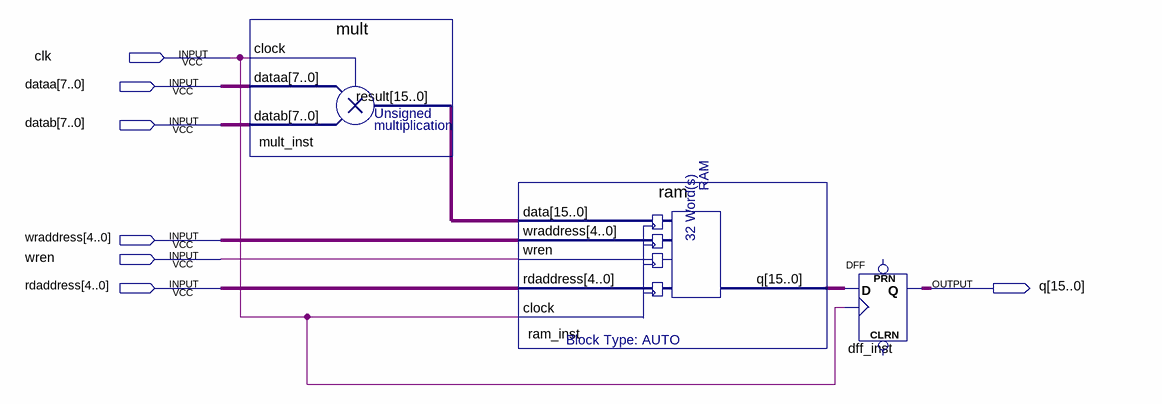
[diagram p0: schematic sheet]
// Quartus schematic pipe.bdf as structural Verilog: 3 symbols, 7 pins
module pipe (
  input  clk,
  input  [7:0] dataa,
  input  [7:0] datab,
  input  [4:0] wraddress,
  input  wren,
  input  [4:0] rdaddress,
  output [15:0] q
);

  wire [15:0] mult_inst_result, ram_inst_q;

  mult mult_inst (.clock(clk), .dataa(dataa), .datab(datab), .result(mult_inst_result));
  ram ram_inst (
    .data(mult_inst_result), .wraddress(wraddress), .wren(wren), .rdaddress(rdaddress), .clock(clk),
    .q(ram_inst_q));
  DFF dff_inst[15:0] (.CLK(clk), .D(ram_inst_q), .Q(q));  // open: CLRN, PRN
endmodule
